# Altium project RocketAcquisitionShield.PrjPcb
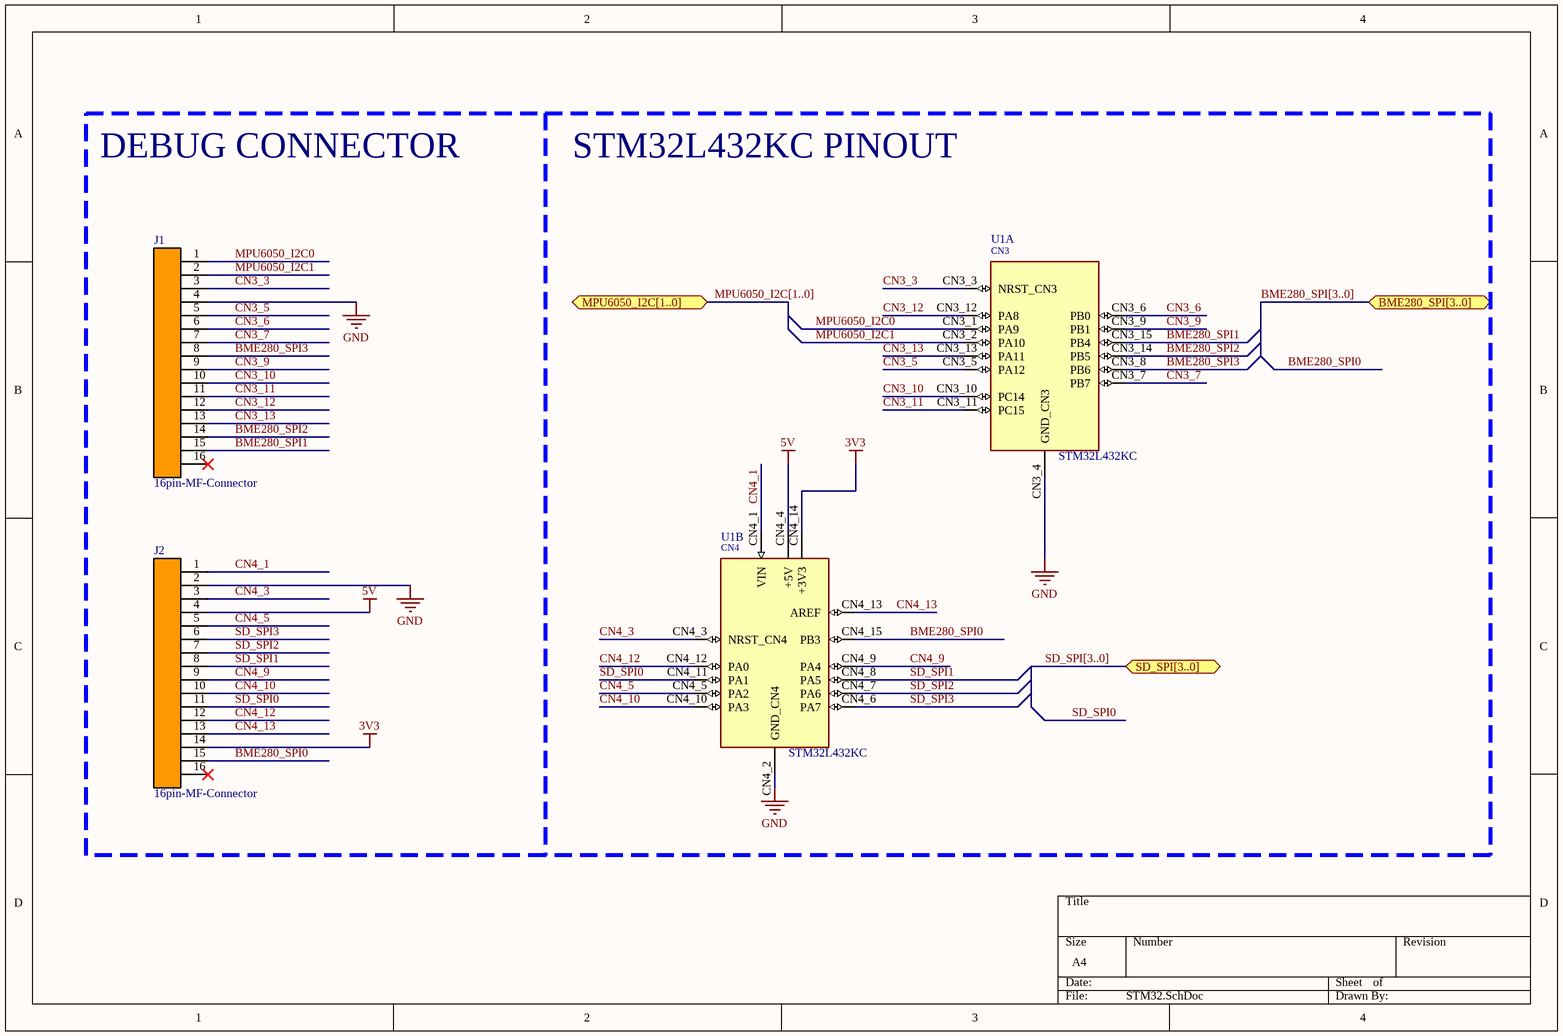
[diagram p0: STM32.SchDoc]
4 sheets, 9 parts. Net scope: flat (ports and power ports of the same name join across sheets).
Board files: CirclePCBV2_3in.PcbDoc, CirclePCBV2.PcbDoc
Sheets:
  STM32.SchDoc
  Sensors.SchDoc
  SD.SchDoc
  Power.SchDoc

## Sheet STM32.SchDoc
size A4

### Parts
J1  16pin-MF-Connector  [16pin-MF-Connector]
J2  16pin-MF-Connector  [16pin-MF-Connector]
U1  STM32L432KC  [STM32L432KC]  (parts A,B of 2)

### Blocks framed on the sheet
DEBUG CONNECTOR: J1 J2

### Ports
BME280_SPI[3..0] (bidir), MPU6050_I2C[1..0] (bidir), SD_SPI[3..0] (bidir)

### Nets
3V3: J2.14 U1.CN4_14(+3V3)
5V: J2.4 U1.CN4_4(+5V)
GND: J1.4 J2.2 U1.CN3_4(GND_CN3) U1.CN4_2(GND_CN4)
BME280_SPI0: J2.15 U1.CN4_15(PB3)
BME280_SPI1: J1.15 U1.CN3_15(PB4)
BME280_SPI2: J1.14 U1.CN3_14(PB5)
BME280_SPI3: J1.8 U1.CN3_8(PB6)
CN3_3: J1.3 U1.CN3_3(NRST_CN3)
CN3_5: J1.5 U1.CN3_5(PA12)
CN3_6: J1.6 U1.CN3_6(PB0)
CN3_7: J1.7 U1.CN3_7(PB7)
CN3_9: J1.9 U1.CN3_9(PB1)
CN3_10: J1.10 U1.CN3_10(PC14)
CN3_11: J1.11 U1.CN3_11(PC15)
CN3_12: J1.12 U1.CN3_12(PA8)
CN3_13: J1.13 U1.CN3_13(PA11)
CN4_1: J2.1 U1.CN4_1(VIN)
CN4_3: J2.3 U1.CN4_3(NRST_CN4)
CN4_5: J2.5 U1.CN4_5(PA2)
CN4_9: J2.9 U1.CN4_9(PA4)
CN4_10: J2.10 U1.CN4_10(PA3)
CN4_12: J2.12 U1.CN4_12(PA0)
CN4_13: J2.13 U1.CN4_13(AREF)
MPU6050_I2C0: J1.1 U1.CN3_1(PA9)
MPU6050_I2C1: J1.2 U1.CN3_2(PA10)
SD_SPI0: J2.11 U1.CN4_11(PA1)
SD_SPI1: J2.8 U1.CN4_8(PA5)
SD_SPI2: J2.7 U1.CN4_7(PA6)
SD_SPI3: J2.6 U1.CN4_6(PA7)

Not connected (* = marked no-connect by the designer): J1 16*; J2 16*

### Buses and harness runs
bus BME280_SPI[3..0] = port BME280_SPI[3..0]
bus MPU6050_I2C[1..0] = port MPU6050_I2C[1..0]
bus SD_SPI[3..0] = port SD_SPI[3..0]

### Notes on the sheet
- STM32L432KC PINOUT
- (in symbol STM32L432KC, part A) CN3
- (in symbol STM32L432KC, part B) CN4

## Sheet Sensors.SchDoc
size A4
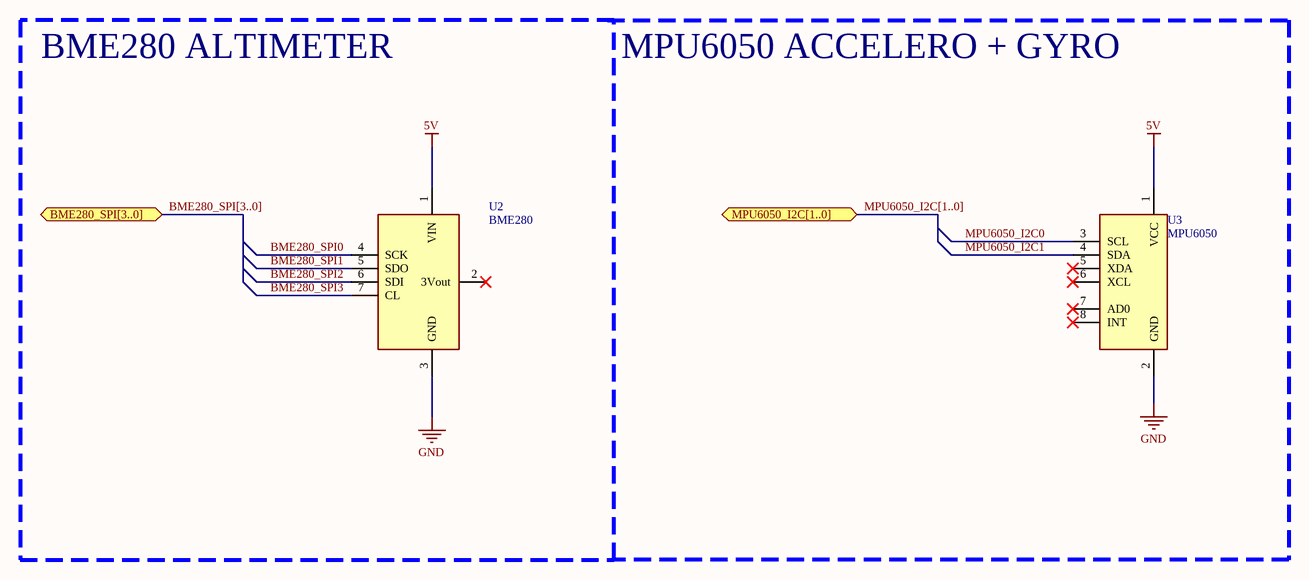
[diagram p1: Sensors.SchDoc]

### Parts
U2  BME280  [BME280]
U3  MPU6050  [MPU6050]

### Blocks framed on the sheet
BME280 ALTIMETER: U2

### Ports
BME280_SPI[3..0] (bidir), MPU6050_I2C[1..0] (bidir)

### Nets
5V: U2.1(VIN) U3.1(VCC)
GND: U2.3(GND) U3.2(GND)
BME280_SPI0: U2.4(SCK)
BME280_SPI1: U2.5(SDO)
BME280_SPI2: U2.6(SDI)
BME280_SPI3: U2.7(CL)
MPU6050_I2C0: U3.3(SCL)
MPU6050_I2C1: U3.4(SDA)

Not connected (* = marked no-connect by the designer): U2 2(3Vout)*; U3 5(XDA)* 6(XCL)* 7(AD0)* 8(INT)*

### Buses and harness runs
bus BME280_SPI[3..0] = port BME280_SPI[3..0]
bus MPU6050_I2C[1..0] = port MPU6050_I2C[1..0]

### Notes on the sheet
- MPU6050 ACCELERO + GYRO

## Sheet SD.SchDoc
size A4
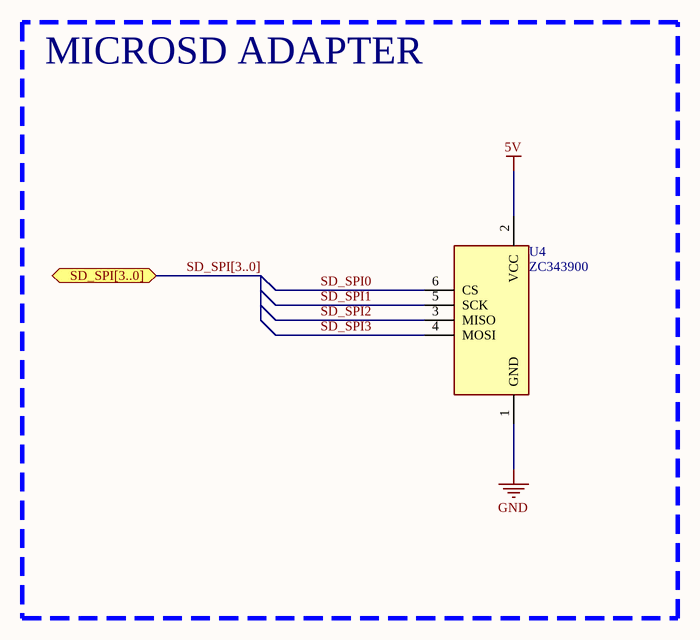
[diagram p2: SD.SchDoc]

### Parts
U4  ZC343900  [ZC343900]

### Blocks framed on the sheet
MICROSD ADAPTER: U4

### Ports
SD_SPI[3..0] (bidir)

### Nets
5V: U4.2(VCC)
GND: U4.1(GND)
SD_SPI0: U4.6(CS)
SD_SPI1: U4.5(SCK)
SD_SPI2: U4.3(MISO)
SD_SPI3: U4.4(MOSI)

### Buses and harness runs
bus SD_SPI[3..0] = port SD_SPI[3..0]

### Library data of the parts
U4 = ZC343900: MicroSD Adapter

## Sheet Power.SchDoc
size A4
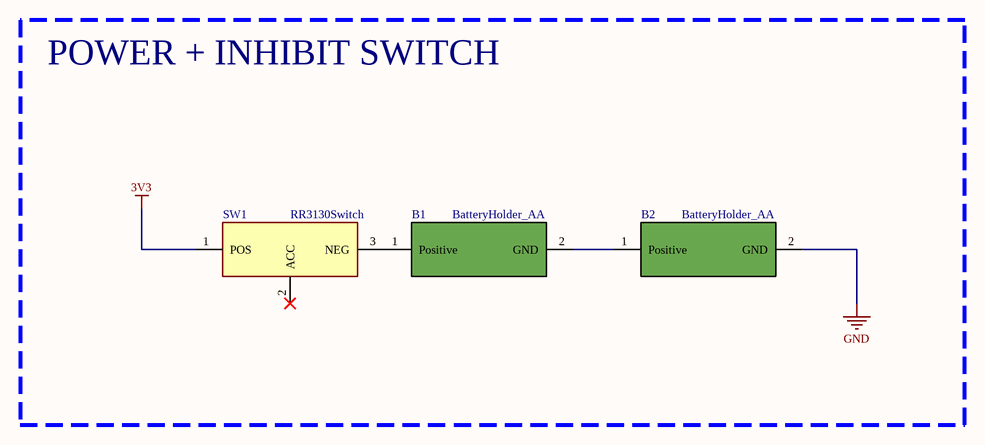
[diagram p3: Power.SchDoc]

### Parts
B1  BatteryHolder_AA  [BatteryHolder_AA]
B2  BatteryHolder_AA  [BatteryHolder_AA]
SW1  RR3130Switch  [RR3130Switch]

### Blocks framed on the sheet
POWER + INHIBIT SWITCH: B1 B2 SW1

### Nets
3V3: SW1.1(POS)
GND: B2.2(GND)
NetB1_1: B1.1(Positive) SW1.3(NEG)
NetB1_2: B1.2(GND) B2.1(Positive)

Not connected (* = marked no-connect by the designer): SW1 2(ACC)*

### Library data of the parts
B1 B2 = BatteryHolder_AA: Keystone Electronics 1088
SW1 = RR3130Switch: SWITCH ROCKER SPST 10A 125V

## Nets that join several sheets
3V3: STM32 (J2.14 U1.CN4_14), Power (SW1.1)
5V: STM32 (J2.4 U1.CN4_4), Sensors (U2.1 U3.1), SD (U4.2)
GND: STM32 (J1.4 J2.2 U1.CN3_4 U1.CN4_2), Sensors (U2.3 U3.2), SD (U4.1), Power (B2.2)
BME280_SPI0: STM32 (J2.15 U1.CN4_15), Sensors (U2.4)
BME280_SPI1: STM32 (J1.15 U1.CN3_15), Sensors (U2.5)
BME280_SPI2: STM32 (J1.14 U1.CN3_14), Sensors (U2.6)
BME280_SPI3: STM32 (J1.8 U1.CN3_8), Sensors (U2.7)
MPU6050_I2C0: STM32 (J1.1 U1.CN3_1), Sensors (U3.3)
MPU6050_I2C1: STM32 (J1.2 U1.CN3_2), Sensors (U3.4)
SD_SPI0: STM32 (J2.11 U1.CN4_11), SD (U4.6)
SD_SPI1: STM32 (J2.8 U1.CN4_8), SD (U4.5)
SD_SPI2: STM32 (J2.7 U1.CN4_7), SD (U4.3)
SD_SPI3: STM32 (J2.6 U1.CN4_6), SD (U4.4)